# Altium schematic sheet Sub-A_BPF.SchDoc
size A; SheetNumber: 2; SheetTotal: 6
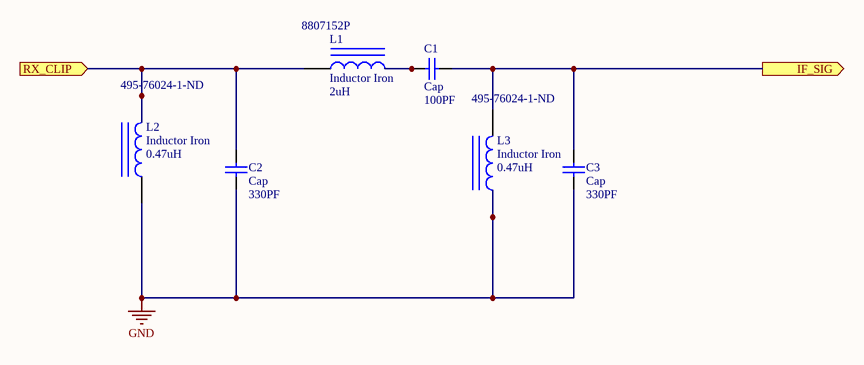
[diagram p0: Sub-A_BPF.SchDoc]

## Parts
C1  Cap  value 100PF  [RADIAL-0.1]
C2  Cap  value 330PF  [RADIAL-0.1]
C3  Cap  value 330PF  [RADIAL-0.1]
L1  Inductor Iron  value 2uH  Supplier Part Number 1: 8807152P  [AXIAL-0.9]
L2  Inductor Iron  value 0.47uH  Supplier Part Number 1: 495-76024-1-ND  [AXIAL-0.9]
L3  Inductor Iron  value 0.47uH  Supplier Part Number 1: 495-76024-1-ND  [AXIAL-0.9]

## Ports
IF_SIG (out), RX_CLIP (in)

## Nets
GND: C2.1 C3.1 L2.1 L3.1
IF_SIG: C1.2 C3.2 L3.2 ; port IF_SIG
RX_CLIP: C2.2 L1.1 L2.2 ; port RX_CLIP
NetC1_1: C1.1 L1.2

## Library data of the parts
C1 = CAP CER 100PF 50V C0G/NP0 RADIAL: Capacitor; Manufacturer Part Number: K101K15C0GF53L2; Designator: C?; Voltage Rating: 50V; Published: 8-Jun-2000; LatestRevisionDate: 17-Jul-2002; LatestRevisionNote: Re-released for DXP Platform.; Publisher: Altium Limited
C2 C3 = CAP CER 330PF 50V X7R RADIAL: Capacitor; Manufacturer Part Number: K331K15X7RF53L2; Designator: C?; Voltage Rating: 50V; Published: 8-Jun-2000; LatestRevisionDate: 17-Jul-2002; LatestRevisionNote: Re-released for DXP Platform.; Publisher: Altium Limited
L1 = Inductor Iron: VHF-CHOKE                 2uH      4A; Manufacturer: TDK EPCOS; Manufacturer Part Number: B82132A5402M; Core Material: Ferrite; Self Resonant Frequency: 186MHz; Tolerance: 20%; DC Resistance (DCR): 20mR; Test Frequency: 1MHz; Lead/Base Style: Axial; Shielding: Unshielded; Q Factor: 0.02; Published: 24-Mar-1999; LatestRevisionDate: 17-Jul-2002; LatestRevisionNote: Re-released for DXP Platform.; PackageReference: AXIAL-0.9; Publisher: Altium Limited; PackageDescription: Axial Device, Thru-Hole; 2 Leads; 0.9 in Pin Spacing; Supplier 1: RSComponents; RoHS: Yes; Category: Fixed Inductors; Stock 1: 1; Pricing 1: 5=1.76700, 50=1.55200, 125=1.36100, 250=1.27000, 4000=1.20000 (USD); Mount: Through Hole; Case/Package: Axial; Min Operating Temperature: -55°C; Max Operating Temperature: 125°C; Packaging: Tape and Reel; Inductance: 2uH; Max DC Current: 4A; Termination: Axial; Current Rating: 4A; DC Current: 4A; Inductance Tolerance: 20%; Package Quantity: 2000; Resistor Type: Wirewound; Series: B82132; Diameter: 5.5mm; Length: 0.787inch; Height: 19mm; Military Standard: Not; REACH SVHC: No SVHC; ComponentLink1URL: https://datasheet.ciiva.com/3077/01950197-3077074.pdf?src-supplier=Avnet; ComponentLink1Description: https://datasheet.ciiva.com/3077/01950197-3077074.pdf?src-supplier=Avnet
L2 L3 = Inductor Iron: Fixed Ind 470NH 5A 27 Mohm Th; Manufacturer: TDK EPCOS; Manufacturer Part Number: B78108E1471M009; Published: 24-Mar-1999; LatestRevisionDate: 17-Jul-2002; LatestRevisionNote: Re-released for DXP Platform.; PackageReference: AXIAL-0.9; Publisher: Altium Limited; PackageDescription: Axial Device, Thru-Hole; 2 Leads; 0.9 in Pin Spacing; Supplier 1: Digi-Key; RoHS: Yes; Category: Fixed Inductors; Stock 1: 2681; Pricing 1: 1=0.46000, 10=0.40500, 25=0.35440, 50=0.30400, 100=0.27860, 250=0.25328, 500=0.23808, 1000=0.18236 (USD); RoHS Compliant: Yes